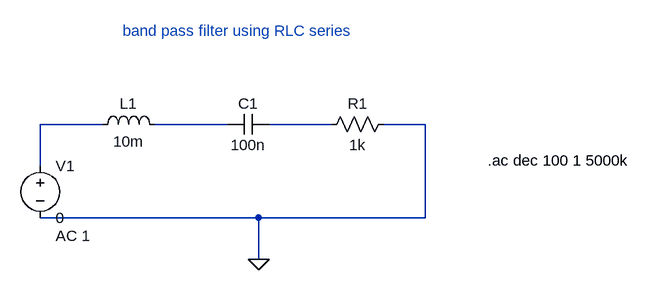
[diagram p0: schematic band_pass_filter1.asc]
band_pass_filter1.asc, the LTspice schematic file:
Version 4
SHEET 1 1468 680
WIRE -512 80 -608 80
WIRE -320 80 -432 80
WIRE -160 80 -256 80
WIRE -16 80 -80 80
WIRE -608 144 -608 80
WIRE -272 224 -608 224
WIRE -16 224 -16 80
WIRE -16 224 -272 224
WIRE -272 288 -272 224
FLAG -272 288 0
SYMBOL res -64 64 R90
WINDOW 0 0 56 VBottom 2
WINDOW 3 32 56 VTop 2
SYMATTR InstName R1
SYMATTR Value 1k
SYMBOL cap -256 64 R90
WINDOW 0 0 32 VBottom 2
WINDOW 3 32 32 VTop 2
SYMATTR InstName C1
SYMATTR Value 100n
SYMBOL ind -528 96 R270
WINDOW 0 32 56 VTop 2
WINDOW 3 5 56 VBottom 2
SYMATTR InstName L1
SYMATTR Value 10m
SYMBOL voltage -608 128 R0
WINDOW 123 24 124 Left 2
WINDOW 39 0 0 Left 0
SYMATTR Value2 AC 1
SYMATTR InstName V1
SYMATTR Value 0
TEXT 80 136 Left 2 !.ac dec 100 1 5000k
TEXT -304 -64 Center 2 ;band pass filter using RLC series

The netlist it stands for:
* band_pass_filter1.asc
R1 0 N003 1k
C1 N003 N002 100n
L1 N001 N002 10m
V1 N001 0 0 AC 1
.ac dec 100 1 5000k
* band pass filter using RLC series
.backanno
.end